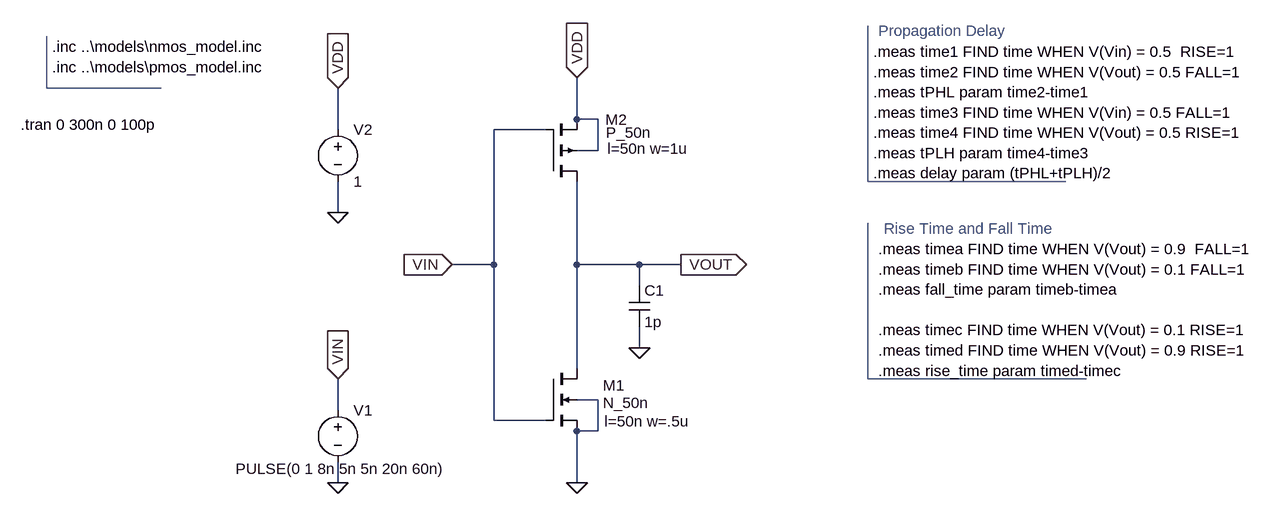
[diagram p0: schematic transient_analysis_power.asc]
transient_analysis_power.asc, the LTspice schematic file:
Version 4.1
SHEET 1 1368 680
WIRE 288 -32 288 -96
WIRE 320 -32 288 -32
WIRE -80 -16 -80 -80
WIRE 240 -16 160 -16
WIRE 320 16 320 -32
WIRE 320 16 288 16
WIRE -80 112 -80 64
WIRE 160 192 160 -16
WIRE 160 192 96 192
WIRE 288 192 288 64
WIRE 384 192 288 192
WIRE 448 192 384 192
WIRE 384 224 384 192
WIRE 384 320 384 288
WIRE 288 352 288 192
WIRE 320 400 288 400
WIRE -80 416 -80 368
WIRE 160 432 160 192
WIRE 240 432 160 432
WIRE 320 448 320 400
WIRE 320 448 288 448
WIRE -80 528 -80 496
WIRE 288 528 288 448
FLAG -80 112 0
FLAG -80 528 0
FLAG 288 528 0
FLAG 288 -96 VDD
IOPIN 288 -96 In
FLAG -80 -80 VDD
IOPIN -80 -80 In
FLAG -80 368 VIN
IOPIN -80 368 In
FLAG 96 192 VIN
IOPIN 96 192 In
FLAG 448 192 VOUT
IOPIN 448 192 Out
FLAG 384 320 0
SYMBOL nmos4 240 352 R0
WINDOW 0 88 26 Left 2
WINDOW 3 88 53 Left 2
WINDOW 123 90 81 Left 2
SYMATTR InstName M1
SYMATTR Value N_50n
SYMATTR Value2 l=50n w=.5u
SYMBOL pmos4 240 64 M180
WINDOW 0 92 95 Left 2
WINDOW 3 93 75 Left 2
WINDOW 123 95 51 Left 2
SYMATTR InstName M2
SYMATTR Value P_50n
SYMATTR Value2 l=50n w=1u
SYMBOL voltage -80 400 R0
WINDOW 3 -157 106 Left 2
WINDOW 123 0 0 Left 0
WINDOW 39 0 0 Left 0
SYMATTR Value PULSE(0 1 8n 5n 5n 20n 60n)
SYMATTR InstName V1
SYMBOL voltage -80 -32 R0
SYMATTR InstName V2
SYMATTR Value 1
SYMBOL cap 368 224 R0
SYMATTR InstName C1
SYMATTR Value 1p
TEXT -520 -144 Left 2 !.inc ..\\models\\nmos_model.inc
TEXT -520 -112 Left 2 !.inc ..\\models\\pmos_model.inc
TEXT 744 -136 Left 2 !.meas time1 FIND time WHEN V(Vin) = 0.5  RISE=1\n.meas time2 FIND time WHEN V(Vout) = 0.5 FALL=1\n.meas tPHL param time2-time1\n.meas time3 FIND time WHEN V(Vin) = 0.5 FALL=1\n.meas time4 FIND time WHEN V(Vout) = 0.5 RISE=1\n.meas tPLH param time4-time3\n.meas delay param (tPHL+tPLH)/2
TEXT -568 -24 Left 2 !.tran 0 300n 0 100p
TEXT 752 168 Left 2 !.meas timea FIND time WHEN V(Vout) = 0.9  FALL=1\n.meas timeb FIND time WHEN V(Vout) = 0.1 FALL=1\n.meas fall_time param timeb-timea\n \n.meas timec FIND time WHEN V(Vout) = 0.1 RISE=1\n.meas timed FIND time WHEN V(Vout) = 0.9 RISE=1\n.meas rise_time param timed-timec
TEXT 752 -168 Left 2 ;Propagation Delay
TEXT 760 136 Left 2 ;Rise Time and Fall Time
LINE Normal -528 -80 -528 -160
LINE Normal -352 -80 -528 -80
LINE Normal 736 64 736 -176
LINE Normal 1040 64 736 64
LINE Normal 736 368 736 128
LINE Normal 1072 368 736 368

The netlist it stands for:
* transient_analysis_power.asc
M1 VOUT VIN 0 0 N_50n l=50n w=.5u
M2 VOUT VIN VDD VDD P_50n l=50n w=1u
V1 VIN 0 PULSE(0 1 8n 5n 5n 20n 60n)
V2 VDD 0 1
C1 VOUT 0 1p
.model NMOS NMOS
.model PMOS PMOS
.lib standard.mos
.inc ..\models\nmos_model.inc
.inc ..\models\pmos_model.inc
.meas time1 FIND time WHEN V(Vin) = 0.5  RISE=1
.meas time2 FIND time WHEN V(Vout) = 0.5 FALL=1
.meas tPHL param time2-time1
.meas time3 FIND time WHEN V(Vin) = 0.5 FALL=1
.meas time4 FIND time WHEN V(Vout) = 0.5 RISE=1
.meas tPLH param time4-time3
.meas delay param (tPHL+tPLH)/2
.tran 0 300n 0 100p
.meas timea FIND time WHEN V(Vout) = 0.9  FALL=1
.meas timeb FIND time WHEN V(Vout) = 0.1 FALL=1
.meas fall_time param timeb-timea
.meas timec FIND time WHEN V(Vout) = 0.1 RISE=1
.meas timed FIND time WHEN V(Vout) = 0.9 RISE=1
.meas rise_time param timed-timec
* Propagation Delay
* Rise Time and Fall Time
.backanno
.end

* Results of the author's LTspice run, read from the files saved beside the schematic
* Operating Point, zero values left out:
*   V(vdd) = 1 V
*   V(vout) = 1 V
*   I(V1) = 18.19 nA
*   I(V2) = -21.21 nA
*   Ib(M1) = -1 pA
*   Ib(M2) = 139.3 pA
*   Id(M1) = 3.643 nA
*   Id(M2) = -3.645 nA
*   Ig(M1) = -620.9 pA
*   Ig(M2) = -17.57 nA
*   Is(M1) = -3.021 nA
*   Is(M2) = 21.07 nA
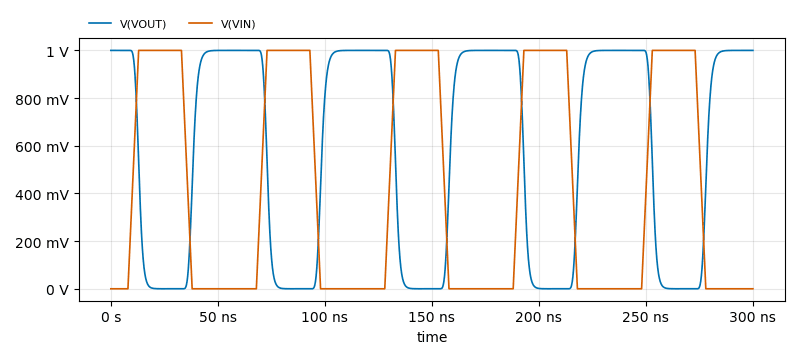
[diagram p1: Transient Analysis of transient_analysis_power.asc, plotted from the saved traces]
* Transient Analysis, 1 run:
*   V(VOUT): min -109.6 µV, max 1 V, average 579 mV, rms 739.3 mV, last 1 V
*   V(VIN): min 0 V, max 1 V, average 416.7 mV, rms 623.6 mV, last 0 V